# Altium schematic sheet Power.SchDoc
size A
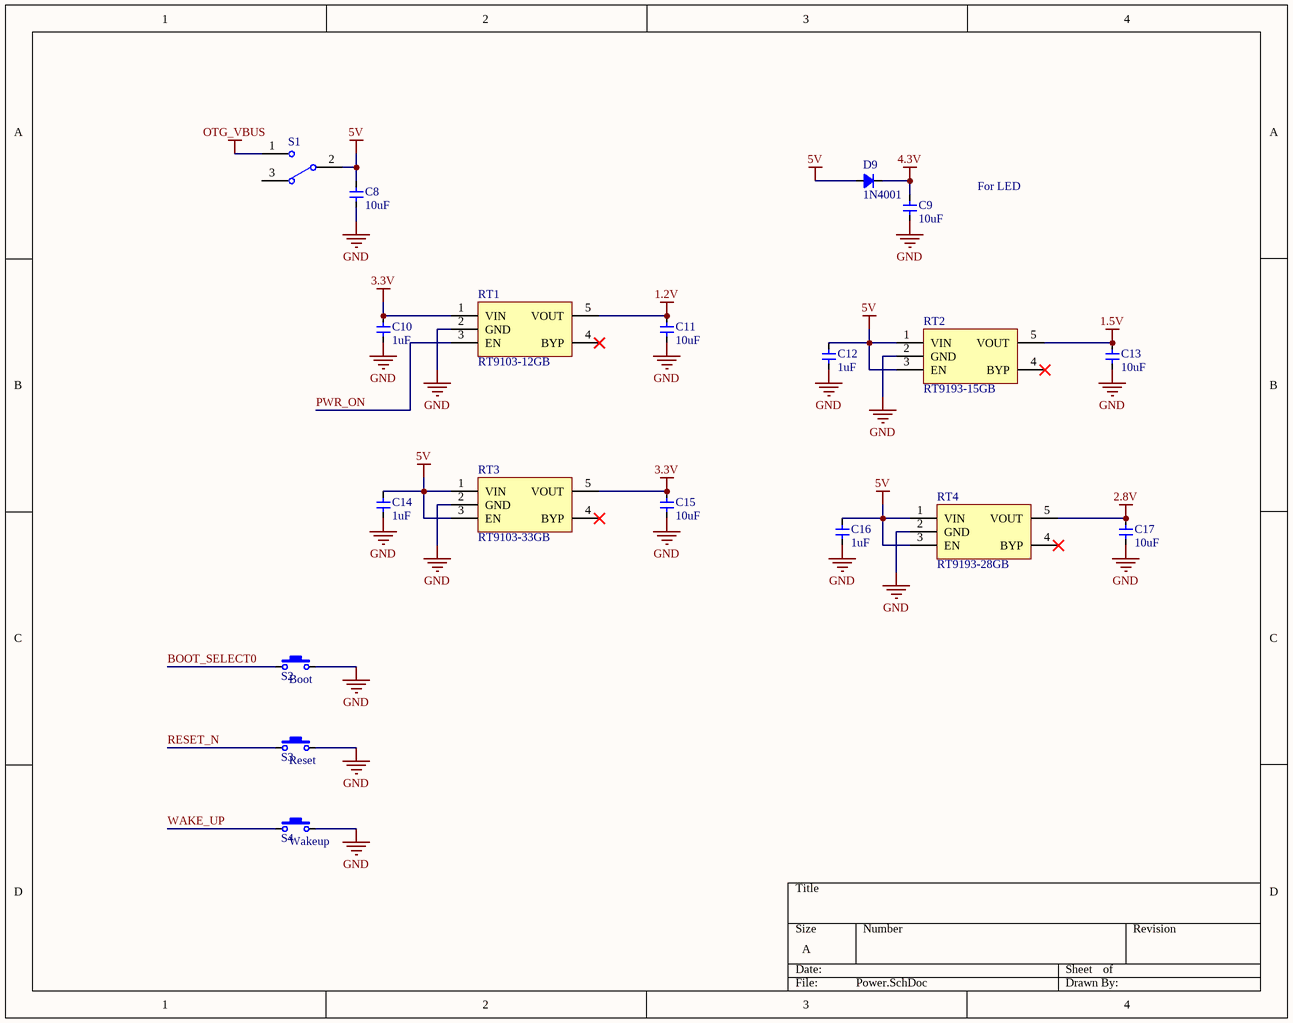
[diagram p0: Power.SchDoc]

## Parts
C8  value 10uF  [CAP_0805]  (hidden comment: Cap_0805)
C9  value 10uF  [CAP_0805]  (hidden comment: Cap_0805)
C10  value 1uF  [CAP_0402]  (hidden comment: Cap_0402)
C11  value 10uF  [CAP_0805]  (hidden comment: Cap_0805)
C12  value 1uF  [CAP_0402]  (hidden comment: Cap_0402)
C13  value 10uF  [CAP_0805]  (hidden comment: Cap_0805)
C14  value 1uF  [CAP_0402]  (hidden comment: Cap_0402)
C15  value 10uF  [CAP_0805]  (hidden comment: Cap_0805)
C16  value 1uF  [CAP_0402]  (hidden comment: Cap_0402)
C17  value 10uF  [CAP_0805]  (hidden comment: Cap_0805)
D9  value 1N4001  [DO-214AC]  (hidden comment: IN4001)
RT1  RT9103-12GB  [SOT23-5]
RT2  RT9193-15GB  [SOT23-5]
RT3  RT9103-33GB  [SOT23-5]
RT4  RT9193-28GB  [SOT23-5]
S1  SwitchSPDT_2.8x6.6_90  [SwitchSPDT_2.8X6.6_90]  (value not drawn)
S2  Boot  [ButtonTACT_3x4x2_180H]
S3  Reset  [ButtonTACT_3x4x2_180H]
S4  Wakeup  [ButtonTACT_3x4x2_180H]

## Nets
1.2V: C11.2 RT1.5(VOUT)
1.5V: C13.2 RT2.5(VOUT)
2.8V: C17.2 RT4.5(VOUT)
3.3V: C10.2 C15.2 RT1.1(VIN) RT3.5(VOUT)
4.3V: C9.2 D9.2(K)
5V: C8.2 C12.2 C14.2 C16.2 D9.1(A) RT2.1(VIN) RT2.3(EN) RT3.1(VIN) RT3.3(EN) RT4.1(VIN) RT4.3(EN) S1.2
GND: C8.1 C9.1 C10.1 C11.1 C12.1 C13.1 C14.1 C15.1 C16.1 C17.1 RT1.2(GND) RT2.2(GND) RT3.2(GND) RT4.2(GND) S2.2 S3.2 S4.2
OTG_VBUS: S1.1
BOOT_SELECT0: S2.1
PWR_ON: RT1.3(EN)
RESET_N: S3.1
WAKE_UP: S4.1

Not connected (* = marked no-connect by the designer): RT1 4(BYP)*; RT2 4(BYP)*; RT3 4(BYP)*; RT4 4(BYP)*; S1 3

## Notes on the sheet
- For LED

## Library data of the parts
C8 C9 C11 C13 C15 C17 = Cap_0805: Capacitor
C10 C12 C14 C16 = Cap_0402: Capacitor
D9 = Diode_SMA: Diode
RT1-RT4 = RT9193: Power
S1 = SwitchSPDT_2.8x6.6_90: Switch
S2-S4 = ButtonTACT_3x4x2_180: Button